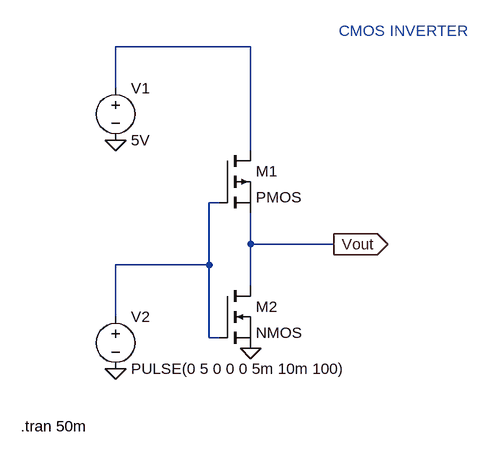
[diagram p0: schematic 9th.asc]
9th.asc, the LTspice schematic file:
Version 4
SHEET 1 880 680
WIRE 224 -48 16 -48
WIRE 16 16 16 -48
WIRE 224 112 224 -48
WIRE 176 192 160 192
WIRE 224 256 224 208
WIRE 352 256 224 256
WIRE 160 288 160 192
WIRE 160 288 16 288
WIRE 224 320 224 256
WIRE 16 368 16 288
WIRE 160 400 160 288
WIRE 176 400 160 400
FLAG 16 96 0
FLAG 16 448 0
FLAG 224 416 0
FLAG 352 256 Vout
IOPIN 352 256 Out
DATAFLAG 320 256 ""
SYMBOL pmos 176 112 R0
SYMATTR InstName M1
SYMBOL nmos 176 320 R0
SYMATTR InstName M2
SYMBOL voltage 16 0 R0
SYMATTR InstName V1
SYMATTR Value 5V
SYMBOL voltage 16 352 R0
WINDOW 123 0 0 Left 0
WINDOW 39 0 0 Left 0
SYMATTR InstName V2
SYMATTR Value PULSE(0 5 0 0 0 5m 10m 100)
TEXT -130 536 Left 2 !.tran 50m
TEXT 360 -72 Left 2 ;CMOS INVERTER

The netlist it stands for:
* 9th.asc
M1 N001 N002 Vout Vout PMOS
M2 Vout N002 0 0 NMOS
V1 N001 0 5V
V2 N002 0 PULSE(0 5 0 0 0 5m 10m 100)
.model NMOS NMOS
.model PMOS PMOS
.lib standard.mos
.tran 50m
* CMOS INVERTER
.backanno
.end